# EasyEDA Pro project 单向户外电源_明月班.epro, schematic 前级推挽升压
Board Name: 前级; Create Date: 2025-08-16; Page Name: 前级升压; Project Name: 单向户外电源; Schematic Name: 前级推挽升压; Update Date: 2025-09-04; Company: 嘉立创EDA; Page Size: A4; Version: V1.0
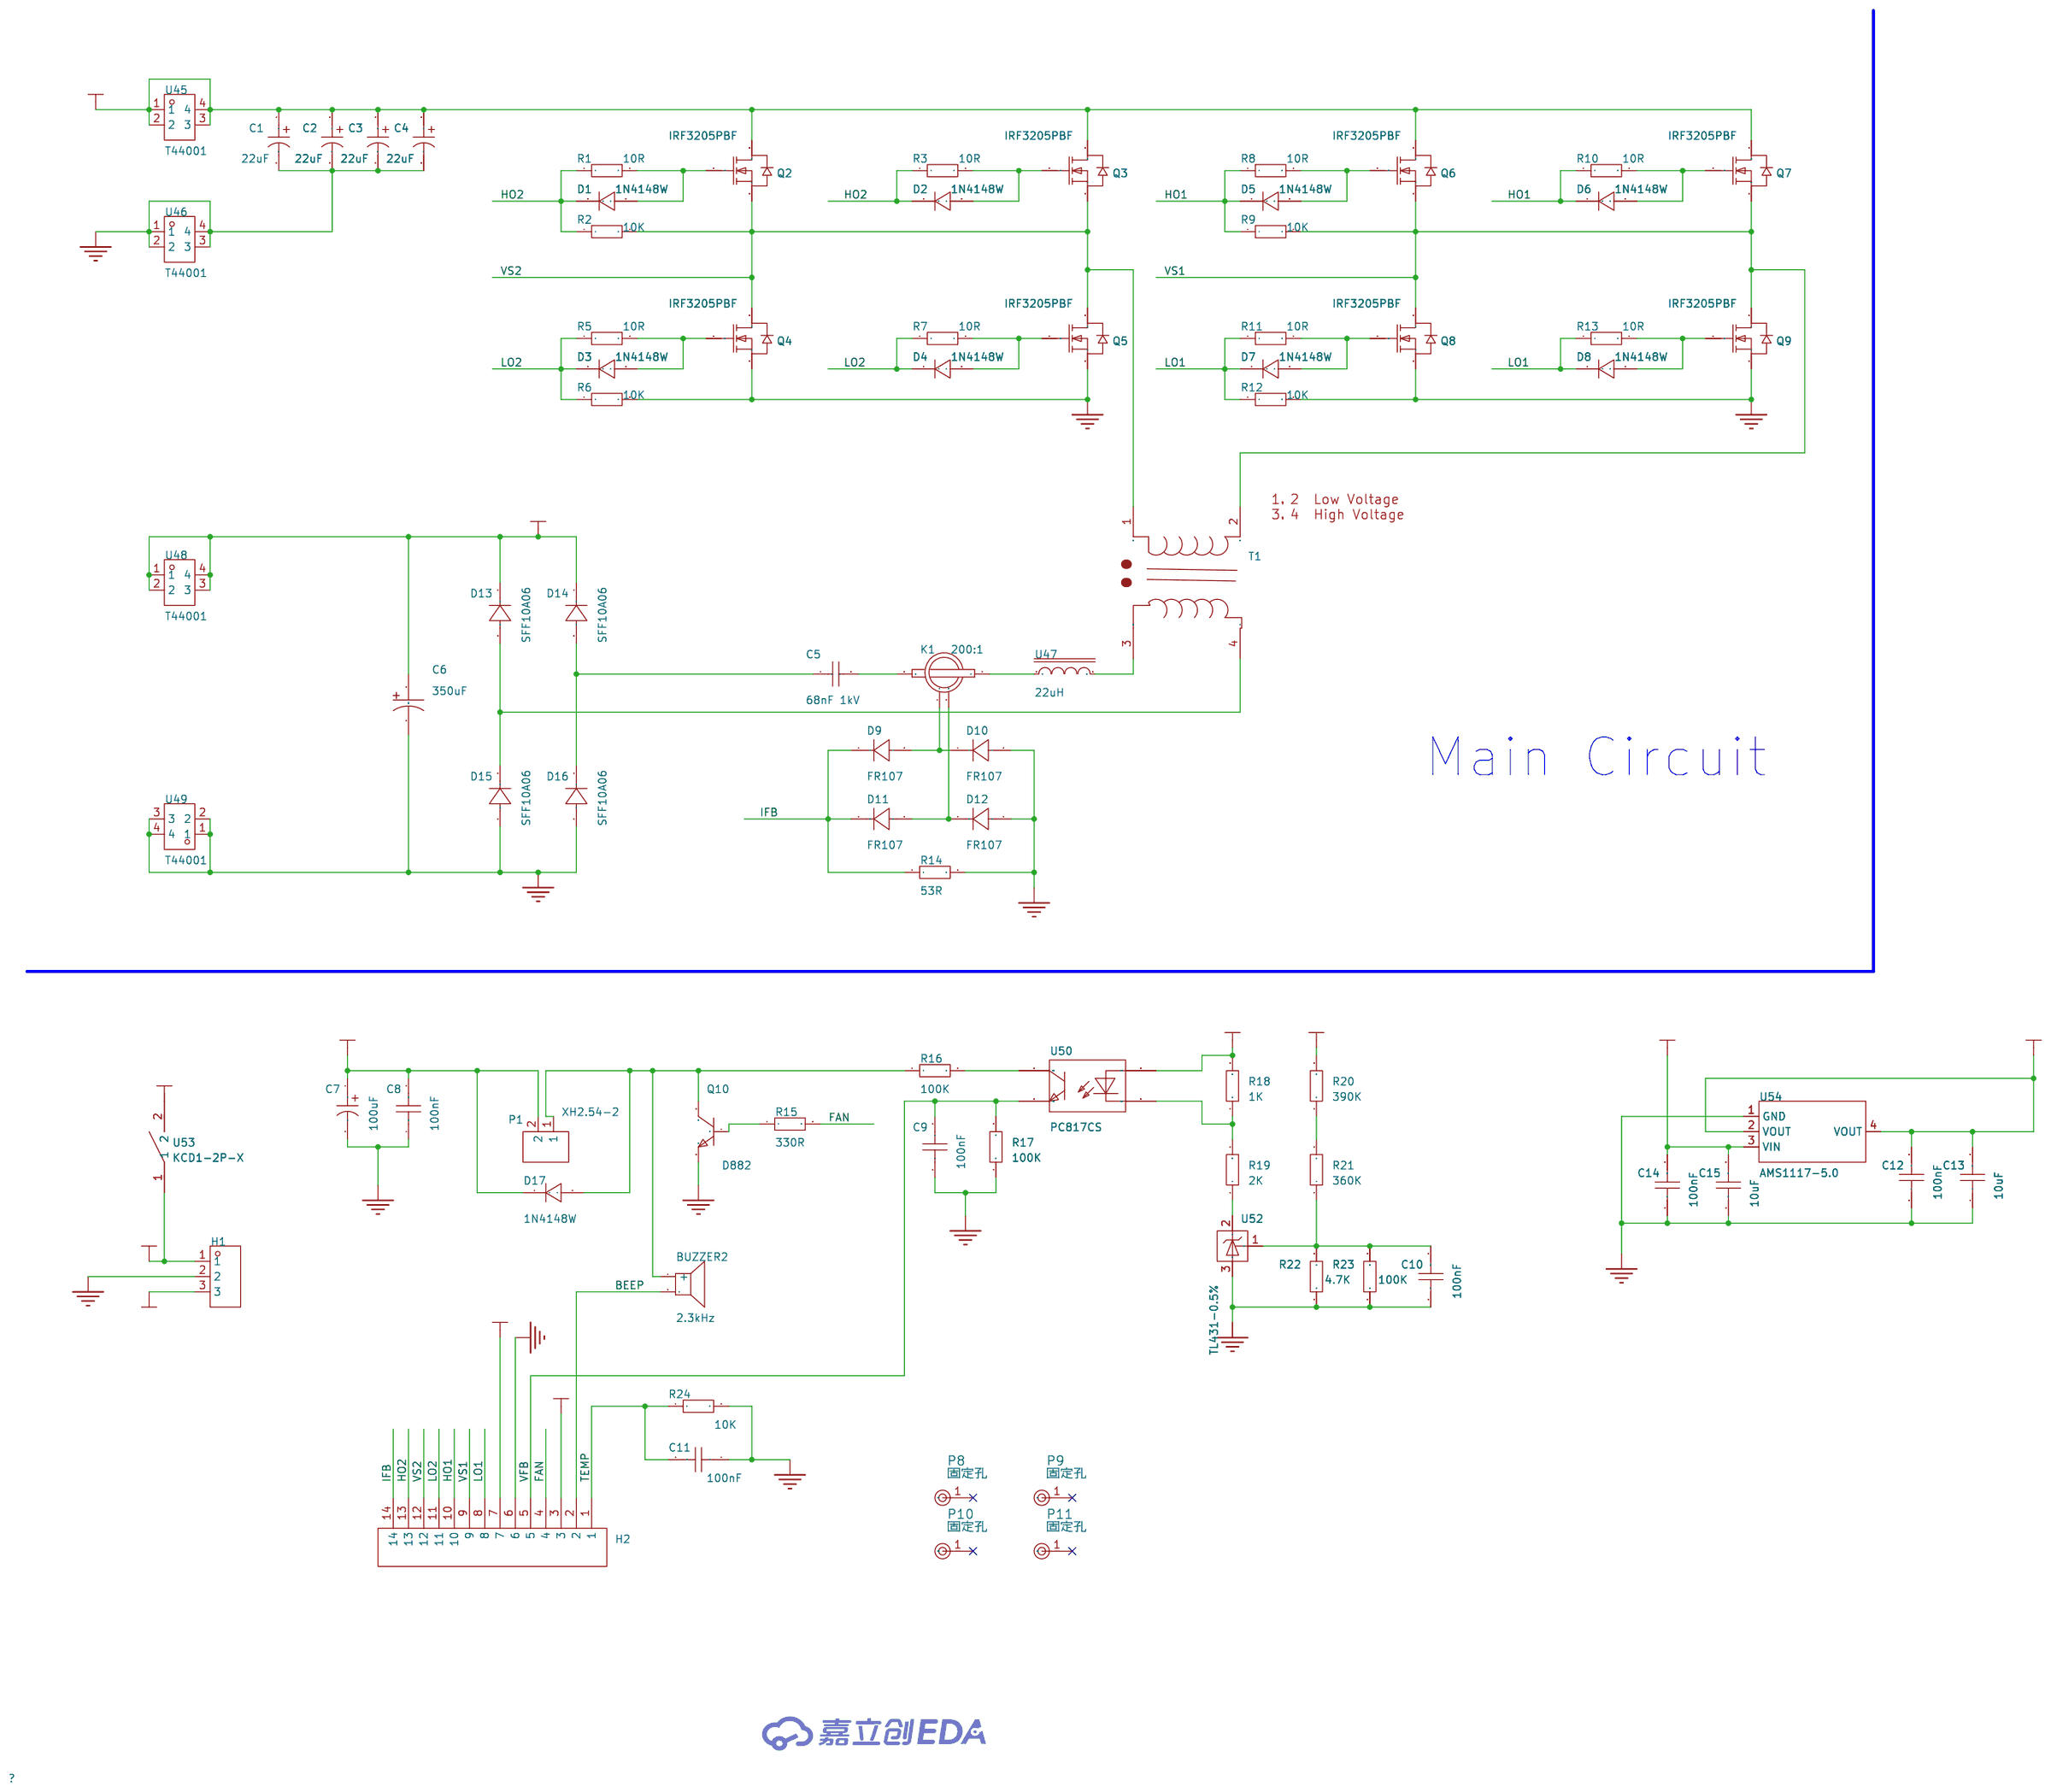
[diagram p2: schematic sheet]

## Parts
BUZZER2  2.3kHz  [BUZ-TH_BD12.0-P7.60-D0.6-FD]
C1  22uF  [CAP-TH_BD6.3-P2.50-D0.6-FD-1]
C2  22uF  [CAP-TH_BD6.3-P2.50-D0.6-FD-1]
C3  22uF  [CAP-TH_BD6.3-P2.50-D0.6-FD-1]
C4  22uF  [CAP-TH_BD6.3-P2.50-D0.6-FD-1]
C5  68nF 1kV  [CAP-TH_L17.0-W12.0-P15.00-D0.8]
C6  350uF  [CAP-TH_BD25.0-P10.00-D2.3-FD]
C7  100uF  [CAP-TH_BD5.0-P2.00-D0.5-FD-1]
C8  100nF  [C0805]
C9  100nF  [C0805]
C10  100nF  [C0805]
C11  100nF  [C0805]
C12  100nF  [C0805]
C13  10uF  [C0805]
C14  100nF  [C0805]
C15  10uF  [C0805]
D1  1N4148W  [SOD-123F_L2.7-W1.6-LS3.8-RD]
D2  1N4148W  [SOD-123F_L2.7-W1.6-LS3.8-RD]
D3  1N4148W  [SOD-123F_L2.7-W1.6-LS3.8-RD]
D4  1N4148W  [SOD-123F_L2.7-W1.6-LS3.8-RD]
D5  1N4148W  [SOD-123F_L2.7-W1.6-LS3.8-RD]
D6  1N4148W  [SOD-123F_L2.7-W1.6-LS3.8-RD]
D7  1N4148W  [SOD-123F_L2.7-W1.6-LS3.8-RD]
D8  1N4148W  [SOD-123F_L2.7-W1.6-LS3.8-RD]
D9  FR107  [SMA_L4.2-W2.7-LS5.3-RD]
D10  FR107  [SMA_L4.2-W2.7-LS5.3-RD]
D11  FR107  [SMA_L4.2-W2.7-LS5.3-RD]
D12  FR107  [SMA_L4.2-W2.7-LS5.3-RD]
D13  SFF10A06  [ITO-220AC_L10.2-W4.5-P5.10]
D14  SFF10A06  [ITO-220AC_L10.2-W4.5-P5.10]
D15  SFF10A06  [ITO-220AC_L10.2-W4.5-P5.10]
D16  SFF10A06  [ITO-220AC_L10.2-W4.5-P5.10]
D17  1N4148W  [SOD-123F_L2.7-W1.6-LS3.8-RD]
H1  -  [HDR-TH_3P-P2.54-V-F]
H2  -  [HDR-TH_14P-P2.54-V-F-1]
K1  200:1  [FILTER-TH_4P-L12.0-W12.0_FC-CT9825-200T-40A]
P1  XH2.54-2  [CONN-TH_XH2.54-2P]
P8  固定孔  [固定孔]
P9  固定孔  [固定孔]
P10  固定孔  [固定孔]
P11  固定孔  [固定孔]
Q2  IRF3205PBF  [T0-220]
Q3  IRF3205PBF  [T0-220]
Q4  IRF3205PBF  [T0-220]
Q5  IRF3205PBF  [T0-220]
Q6  IRF3205PBF  [T0-220]
Q7  IRF3205PBF  [T0-220]
Q8  IRF3205PBF  [T0-220]
Q9  IRF3205PBF  [T0-220]
Q10  D882  [SOT-89-3_L4.5-W2.5-P1.50-LS4.2-BR]
R1  10R  [R0805]
R2  10K  [R0805]
R3  10R  [R0805]
R5  10R  [R0805]
R6  10K  [R0805]
R7  10R  [R0805]
R8  10R  [R0805]
R9  10K  [R0805]
R10  10R  [R0805]
R11  10R  [R0805]
R12  10K  [R0805]
R13  10R  [R0805]
R14  53R  [R0805]
R15  330R  [R0805]
R16  100K  [R0805]
R17  100K  [R0805]
R18  1K  [R0805]
R19  2K  [R0805]
R20  390K  [R0805]
R21  360K  [R0805]
R22  4.7K  [R0805]
R23  100K  [R0805]
R24  10K  [R0805]
T1  -  [EQ4020]
U45  T44001  [CONN-TH_T44001]
U46  T44001  [CONN-TH_T44001]
U47  22uH  [IND-TH_L20.0-W9.0-P8.00-D1.0]
U48  T44001  [CONN-TH_T44001]
U49  T44001  [CONN-TH_T44001]
U50  PC817CS  [SOP-4_L6.5-W4.6-P2.54-LS10.2-BL]
U52  TL431-0.5%  [SOT-23-3_L2.9-W1.6-P1.90-LS2.8-BR]
U53  KCD1-2P-X  [SW-TH_KCD1-101]
U54  AMS1117-5.0  [SOT-223_L6.5-W3.5-P2.30-LS7.0-BR]

## Library data of the parts
BUZZER2 = TMB12A12_C96079: 驱动方式:有源(内含驱动线路);构造类型:电磁式;频率:2.3kHz;声压(SPL):85dB;; LCSC Part Name: TMB12A12; Supplier Part: C96079; Manufacturer: 华能; Manufacturer Part: TMB12A12; Supplier Footprint: 插件,D=12mm; JLCPCB Part Class: 扩展库; Datasheet: https://atta.szlcsc.com/upload/public/pdf/source/20170522/1495448324467.pdf; Supplier: LCSC; Oscillator Circuit: 有源(内含驱动线路); Technology Type: 电磁式; Operating Voltage: 8V~16V; Sound Pressure Level (SPL): 85dB; Diameter (φD): 12mm; Height: 9.8mm
C1-C4 = PA50V22M6x7: 容值:22uF;精度:±20%;额定电压:50V;纹波电流:2.6A@100kHz;等效串联电阻(ESR):40mΩ@100kHz;类型:聚合物;; LCSC Part Name: 22uF ±20% 50V; Supplier Part: C46550455; Manufacturer: 捷而瑞; Supplier Footprint: 插件,D6.3xL7mm; JLCPCB Part Class: 扩展库; Datasheet: https://atta.szlcsc.com/upload/public/pdf/source/20250307/831193F737CAF6D75AC25F14E955F0EC.pdf; Supplier: LCSC; Tolerance: ±20%; Voltage Rating: 50V; Ripple Current: 2.6A@100kHz; Equivalent Series Resistance(ESR): 40mΩ@100kHz; Type: 聚合物; Diameter: 6.3mm; Height - Seated (Max): 7mm; Lifetime: 2000hrs@105℃; Operating Temperature: -55℃~+105℃
C5 = PS683J3A1502: 容值:68nF;精度:±5%;额定电压:1kV;工作温度:-40℃~+100℃;; LCSC Part Name: 68nF ±5% 1kV; Supplier Part: C478444; Manufacturer: KYET(科雅); Supplier Footprint: 插件,P=15mm; JLCPCB Part Class: 扩展库; Datasheet: https://atta.szlcsc.com/upload/public/pdf/source/20200102/C478444_4F70048084F20B040C2A21F2E8B9CC60.pdf; Supplier: LCSC; Tolerance: ±5%; Voltage Rated: 1kV; Operating Temperature: -40℃~+100℃
C6 = TLA450V220UF25.4*40: 容值:220uF;精度:±20%;额定电压:450V;脚间距:10mm;等效串联电阻(ESR):-;纹波电流:1A@120Hz;; LCSC Part Name: 220uF ±20% 450V; Supplier Part: C150385; Manufacturer: SAMYOUNG(韩国三莹); Supplier Footprint: 插件,D25.4xL40mm; JLCPCB Part Class: 扩展库; Datasheet: https://atta.szlcsc.com/upload/public/pdf/source/20171221/C150385_15138312224721195452.pdf; Supplier: LCSC; Tolerance: ±20%; Voltage Rating: 450V; Pin Spacing: 10mm; Ripple Current: 1A@120Hz; Diameter: 25.4mm; Height - Seated (Max): 40mm; Lifetime: 3000hrs@105℃; Operating Temperature: -25℃~+105℃
C7 = JBLE2101M025A080RLM 100UF 25V: 容值:100uF;精度:±20%;额定电压:25V;纹波电流:1.1A@100kHz;等效串联电阻(ESR):40mΩ@100kHz;; LCSC Part Name: 100uF ±20% 25V; Supplier Part: C19270657; Manufacturer: DMBJ(振宝佳); Supplier Footprint: 插件,D5xL8mm; JLCPCB Part Class: 扩展库; Datasheet: https://atta.szlcsc.com/upload/public/pdf/source/20240115/41B2053578AA7A05F5193847DE8DA961.pdf; Supplier: LCSC; Tolerance: ±20%; Voltage Rating: 25V; Ripple Current: 1.1A@100kHz; Equivalent Series Resistance(ESR): 40mΩ@100kHz; Lifetime: 2000hrs@105℃
C8-C15 = CAP_0805: Supplier Footprint: 0805
D1-D8 D17 = 1N4148W_C81598: 二极管配置:独立式;正向压降(Vf):1V@50mA;直流反向耐压(Vr):75V;整流电流:150mA;反向恢复时间(Trr):4ns;; Supplier Part: C81598; Manufacturer: ST(先科); Supplier Footprint: SOD-123; JLCPCB Part Class: 基础库; Datasheet: https://item.szlcsc.com/datasheet/1N4148W/82750.html; Supplier: LCSC; Diode Configuration: 独立式; Voltage - Forward(Vf@If): 1V@50mA; Voltage - DC Reverse(Vr): 75V; Current - Rectified: 150mA; Pd - Power Dissipation: 400mW; Reverse Leakage Current (Ir): 1uA@75V; Reverse Recovery Time (trr): 4ns; Non-Repetitive Peak Forward Surge Current: 1A
D9-D12 = FR107_C2892324: 二极管配置:1个独立式;正向压降(Vf):1.3V@1A;直流反向耐压(Vr):1kV;整流电流:1A;反向恢复时间(Trr):500ns;; Supplier Part: C2892324; Manufacturer: YONGYUTAI(永裕泰); Supplier Footprint: SMA; JLCPCB Part Class: 扩展库; Datasheet: https://item.szlcsc.com/datasheet/FR107/3124344.html; Supplier: LCSC; Diode Configuration: 1个独立式; Voltage - Forward(Vf@If): 1.3V@1A; Voltage - DC Reverse(Vr): 1kV; Current - Rectified: 1A; Reverse Leakage Current (Ir): 5uA@1kV; Reverse Recovery Time (trr): 500ns; Operating Junction Temperature Range: -55℃~+150℃; Non-Repetitive Peak Forward Surge Current: 30A
D13-D16 = SFF1006UF: 二极管配置:1个独立式;正向压降(Vf):1.7V@10A;直流反向耐压(Vr):600V;整流电流:10A;反向恢复时间(Trr):35ns;; Supplier Part: C7427747; Manufacturer: NH(纽航); Supplier Footprint: ITO-220AC; JLCPCB Part Class: Extended Part; Datasheet: https://item.szlcsc.com/datasheet/SFF1006UF/8422096.html; Supplier: LCSC; Diode Configuration: 1个独立式; Voltage - Forward(Vf@If): 1.7V@10A; Voltage - DC Reverse(Vr): 600V; Current - Rectified: 10A; Reverse Leakage Current (Ir): 5uA; Reverse Recovery Time (trr): 35ns; Non-Repetitive Peak Forward Surge Current: 100A
H1 = HDR-F_2.54_1x3P: Supplier Part: C541850; Supplier Footprint: 插件
H2 = HDR-F-2.54_1x14P: Supplier Part: C52711; Supplier Footprint: 插件
K1 = 200:1: Published: 24-Mar-1999; LatestRevisionDate: 17-Jul-2002; LatestRevisionNote: Re-released for DXP Platform.; PackageReference: MODULE5B; Publisher: Altium Limited
P1 = XH2.54直插座-2P: Supplier Part: C9900016957; JLCPCB Part Class: 扩展库; Supplier: LCSC
P8-P11 = 固定孔
Q2-Q9 = IRF3205PBF: Supplier: LCSC; Manufacturer: Infineon(英飞凌); Supplier Part: C2561; JLCPCB Part Class: Extended Part
Q10 = D882(RANGE:160-320)_C9634: 晶体管类型:NPN;集电极电流(Ic):3A;集射极击穿电压(Vceo):30V;耗散功率(Pd):500mW;直流电流增益(hFE):160@1A,2V;; LCSC Part Name: Y档 160~320; Supplier Part: C9634; Manufacturer: CJ(江苏长电/长晶); Supplier Footprint: SOT-89-3; JLCPCB Part Class: 基础库; Datasheet: https://atta.szlcsc.com/upload/public/pdf/source/20121027/1457706543612.pdf; Supplier: LCSC; type: NPN; Current - Collector(Ic): 3A; Collector - Emitter Voltage VCEO: 30V; Pd - Power Dissipation: 500mW; DC Current Gain: 160@1A,2V; Transition frequency(fT): 50MHz; Current - Collector Cutoff: 1uA; Vce Saturation(VCE(sat)): 500mV; Operating Temperature: -55℃~+150℃
R1-R3 R5-R24 = Res_0805: Supplier Footprint: 0805
T1 = EQ4020: 全桥准谐振1000W逆变器专用变压器 EQ4020 48v
U45 U46 U48 U49 = T44001: LCSC Part Name: 四脚 M4 二件套; Supplier Part: C481447; Manufacturer: XFCN(兴飞); Supplier Footprint: 插件; JLCPCB Part Class: 扩展库; Datasheet: https://atta.szlcsc.com/upload/public/pdf/source/20200107/C481448_4214B4EB74A46B70BD82BA8A456D4EDD.pdf; Supplier: LCSC
U47 = XR065125T680MV1L: 电感值:68uH;精度:±10%;额定电流:7.8A;类型:环形电感;; Supplier Part: C18213932; Manufacturer: XR(祥如); Supplier Footprint: 插件,D=20mm; JLCPCB Part Class: 扩展库; Datasheet: https://atta.szlcsc.com/upload/public/pdf/source/20231010/22999CD70C41D42FB8CE3B16DBFB61FA.pdf; Supplier: LCSC; Tolerance: ±10%; Current Rating: 7.8A; Type: 环形电感; Wire Diameter: 1mm
U50 = PC817CS_C48642466: 输入类型:DC;正向压降(Vf):1.2V;输出电流:50mA;隔离电压(Vrms):5kV;直流反向耐压(Vr):6V;负载电压:80V;输出通道数:1;集射极饱和电压(VCE(sat)):100mV@20mA,1mA;; Supplier Part: C48642466; Manufacturer: QNHCHIP(乾能惠); Supplier Footprint: SOP-4; JLCPCB Part Class: 扩展库; Datasheet: https://item.szlcsc.com/datasheet/PC817CS/50921808.html; Supplier: LCSC; Input type: DC; Output Type: 光电三极管; Voltage - Forward(Vf): 1.2V; Output Current: 50mA; Isolation Voltage(Vrms): 5kV; Reverse Voltage: 6V; Load Voltage: 80V; Number of Outputs: 1; Vce Saturation(VCE(sat)): 100mV@20mA,1mA; Rise time: 4us; Fall time: 3us; Operating Temperature: 55℃~+110℃; Current Transfer Ratio (CTR) Minimum: 50%; Current Transfer Ratio (CTR) Maximum/Saturation Value: 600%; Total Power Dissipation(Pd): 200mW; Forward Current(If): 50mA
U52 = TL431-0.5%_C2874163: LCSC Part Name: TL431-0.5% 停产; Supplier Part: C2874163; Manufacturer: GOFORD(谷峰); Supplier Footprint: SOT-23; JLCPCB Part Class: 扩展库; Datasheet: https://atta.szlcsc.com/upload/public/pdf/source/20210810/02A0BB82282FBCACF58140E8DCCF3C6A.pdf; Supplier: LCSC
U53 = KCD1-2P-X: 带灯:无;引脚样式:焊片;额定电流:6A;额定电压(AC):250V;额定电压(DC):-;电路结构:单刀单掷;工作寿命:1万次;; LCSC Part Name: 15*21mm 两脚两档跷板开关 斜面 黑 停产; Supplier Part: C5884416; Manufacturer: SHOU HAN(首韩); Supplier Footprint: 插件; JLCPCB Part Class: 扩展库; Datasheet: https://atta.szlcsc.com/upload/public/pdf/source/20241125/4D5979D86817E71379230DE21064832F.pdf; Supplier: LCSC; Length: 21mm; Width: 15mm; Switch Height: 21mm; Actuator Type: 凹面弯曲; With Lamp: 无; Termination Style: 焊片; Actuator Color: 黑色; Current Rating: 6A; Voltage Rating (AC): 250V; Circuit: 单刀单掷; Life: 1万次; Operating Temperature: 0℃~+125℃; Actuator Identifier: - O
U54 = AMS1117-5.0_C6187: 输出类型:固定;工作电压:12V;输出电压:5V;输出电流:1A;电源纹波抑制比(PSRR):-;输出极性:正极;; LCSC Part Name: 输入12V 输出5V 1A; Supplier Part: C6187; Manufacturer: AMS; Supplier Footprint: SOT-223; JLCPCB Part Class: 基础库; Datasheet: https://atta.szlcsc.com/upload/public/pdf/source/20230918/E4B716057EE82179D88E8A0894830D59.pdf; Supplier: LCSC; Output Type: 固定; Voltage - Supply: 12V; Output Voltage: 5V; Output Current: 1A; Voltage Dropout: 1.3V@(1A); Features: 过流保护(OCP); Output Configuration: 正极; Number of Outputs: 1

## Nets
5V: C12.2 C13.2 R18.2 U50.1(Anode) U54.2(VOUT) U54.4(VOUT)
12V: C7.1 C8.2 C14.2 C15.2 D17.1(K) H1.3 H2.7 P1.2 U54.3(VIN)
400V: C6.1 D13.1(K) D14.1(K) R20.2 U48.1 U48.2 U48.3 U48.4
GND-24V: C1.2 C2.2 C3.2 C4.2 C7.2 C8.1 C9.1 C11.1 C12.1 C13.1 C14.1 C15.1 D10.2(A) D12.2(A) H1.2 H2.6 Q4.3(S) Q5.3(S) Q8.3(S) Q9.3(S) Q10.3(E) R6.2 R12.2 R14.2 R17.1 R24.2 U46.1 U46.2 U46.3 U46.4 U54.1(GND)
GND-400V: C6.2 C10.1 D15.2(A) D16.2(A) R22.1 R23.1 U49.1 U49.2 U49.3 U49.4 U52.3(A)
BAT: H1.1 H2.3 U53.1
BAT+: C1.1 C2.1 C3.1 C4.1 Q2.2(D) Q3.2(D) Q6.2(D) Q7.2(D) U45.1 U45.2 U45.3 U45.4 U53.2
BEEP: BUZZER2.2 H2.2
FAN: H2.4 R15.2
HO1: D5.1(K) D6.1(K) H2.10 R8.1 R9.1 R10.1
HO2: D1.1(K) D2.1(K) H2.13 R1.1 R2.1 R3.1
IFB: D9.1(K) D11.1(K) H2.14 R14.1
LO1: D7.1(K) D8.1(K) H2.8 R11.1 R12.1 R13.1
LO2: D3.1(K) D4.1(K) H2.11 R5.1 R6.1 R7.1
TEMP: C11.2 H2.1 R24.1
VFB: C9.2 H2.5 R17.2 U50.3(Emitter)
VS1: H2.9 Q6.3(S) Q7.3(S) Q8.2(D) Q9.2(D) R9.2 T1.2
VS2: H2.12 Q2.3(S) Q3.3(S) Q4.2(D) Q5.2(D) R2.2 T1.1
$1N807: D1.2(A) Q2.1(G) R1.2
$1N1000: D2.2(A) Q3.1(G) R3.2
$1N1133: D3.2(A) Q4.1(G) R5.2
$1N1266: D4.2(A) Q5.1(G) R7.2
$1N1906: D5.2(A) Q6.1(G) R8.2
$1N1921: D6.2(A) Q7.1(G) R10.2
$1N1926: D7.2(A) Q8.1(G) R11.2
$1N1936: D8.2(A) Q9.1(G) R13.2
$1N3910: T1.3 U47.2
$1N3915: K1.4 U47.1
$1N3920: C5.2 K1.3
$1N4115: D9.2(A) D10.1(K) K1.1
$1N4120: D11.2(A) D12.1(K) K1.2
$1N4652: D13.2(A) D15.1(K) T1.4
$1N4656: C5.1 D14.2(A) D16.1(K)
$1N5553: BUZZER2.1(+) D17.2(A) P1.1 Q10.2(C) R16.1
$1N5642: Q10.1(B) R15.1
$1N6418: R19.1 U52.2(K)
$1N6499: R20.1 R21.2
$1N6614: C10.2 R21.1 R22.2 R23.2 U52.1(R)
$1N14100: R18.1 R19.2 U50.2(Cathode)
$1N14110: R16.2 U50.4(Collector)

Not connected (* = marked no-connect by the designer): P8 1(3mm洞)*; P9 1(3mm洞)*; P10 1(3mm洞)*; P11 1(3mm洞)*

## Notes on the sheet
- 1，2  Low Voltage
  3，4  High Voltage
- Main Circuit
